# Altium schematic sheet Yitran_IT900_Hutschiene_PIM7A_908_1_4_und_Adapter_2.SchDoc
size 286 x 202 mm
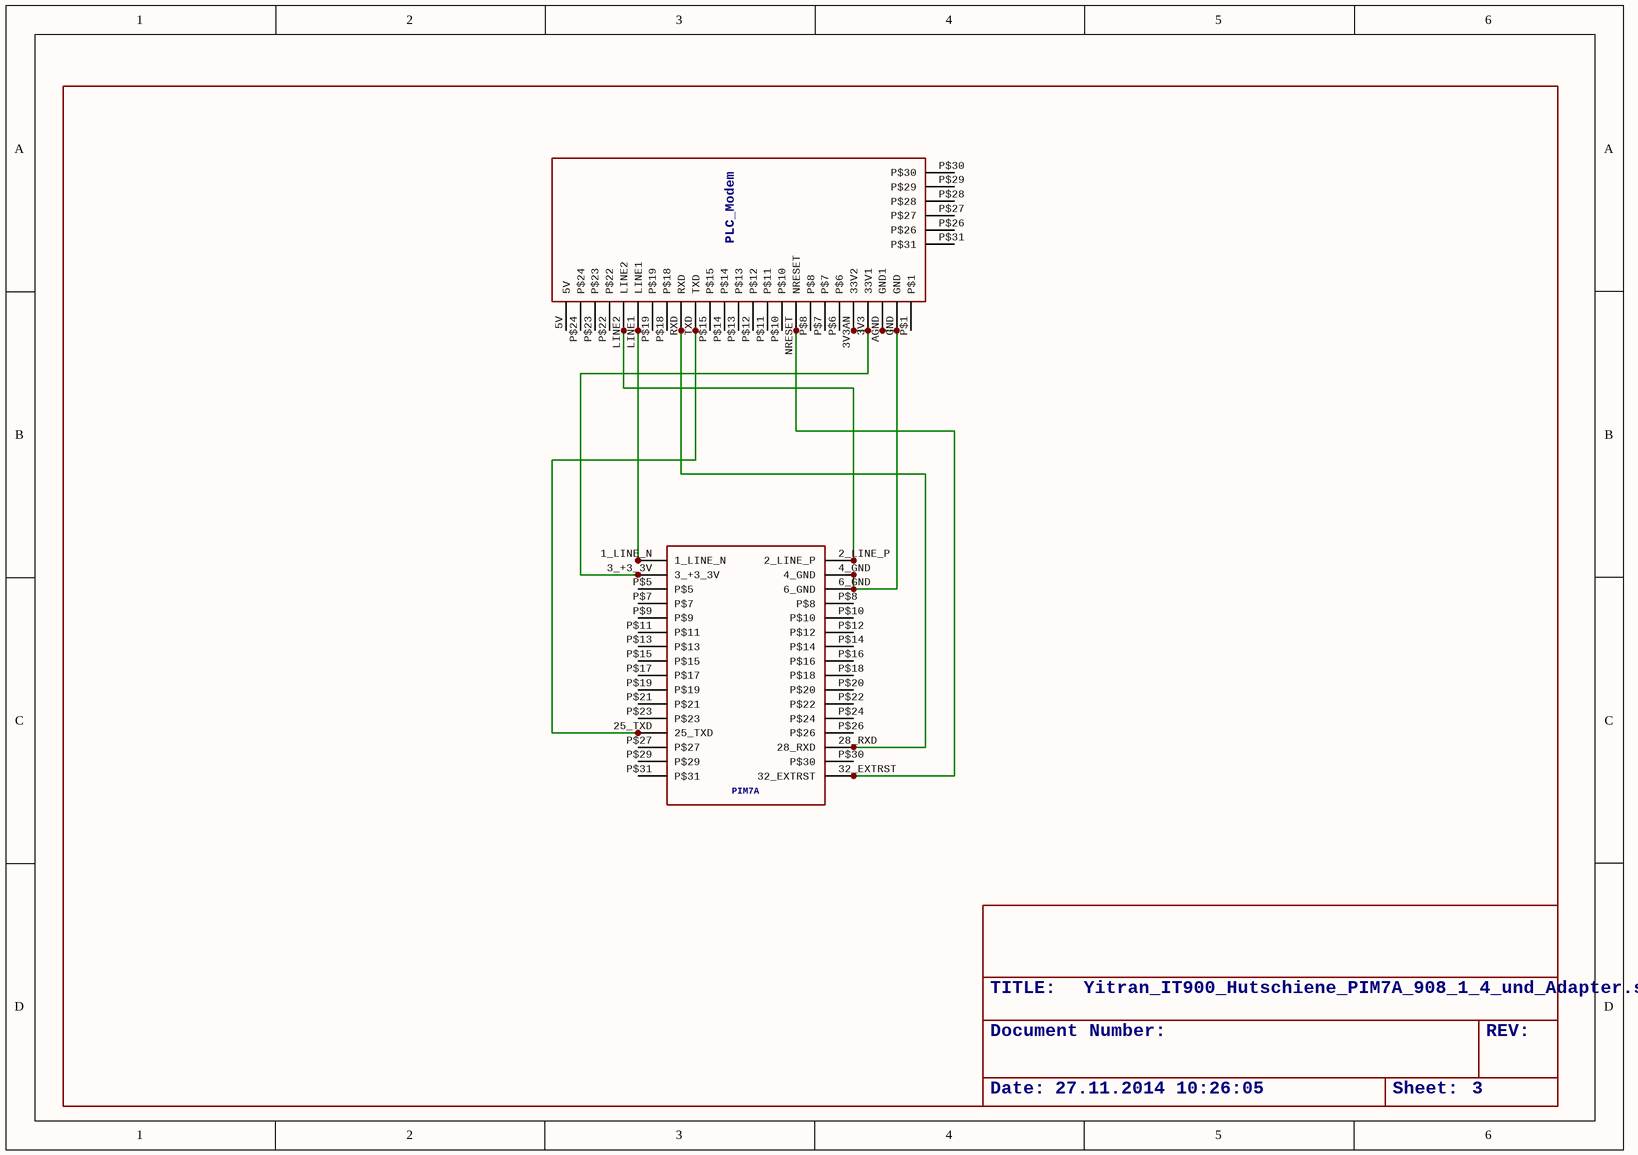
[diagram p0: Yitran_IT900_Hutschiene_PIM7A_908_1_4_und_Adapter_2.SchDoc]

## Parts
FRAME3  DINA4_L  (value not drawn)  (parts A,B of 2)
U$7  MODEMSTECKER_KLEINE_PINS  [MODEM_FUSS_KLEINE_PINS]  (value not drawn)
U$8  IT900PIM7A  [IT900PIM7A]  (value not drawn)

## Nets
NetU$7_3V3: U$7.3V3(33V1) U$7.3V3AN(33V2) U$8.3_+3_3V
NetU$7_AGND: U$7.AGND(GND1) U$7.GND U$8.4_GND U$8.6_GND
NetU$7_LINE1: U$7.LINE1 U$8.1_LINE_N
NetU$7_LINE2: U$7.LINE2 U$8.2_LINE_P
NetU$7_NRESET: U$7.NRESET U$8.32_EXTRST
NetU$7_RXD: U$7.RXD U$8.28_RXD
NetU$7_TXD: U$7.TXD U$8.25_TXD

Not connected (* = marked no-connect by the designer): U$7 5V P$1 P$6 P$7 P$8 P$10 P$11 P$12 P$13 P$14 P$15 P$18 P$19 P$22 P$23 P$24 P$26 P$27 P$28 P$29 P$30 P$31; U$8 P$5 P$7 P$8 P$9 P$10 P$11 P$12 P$13 P$14 P$15 P$16 P$17 P$18 P$19 P$20 P$21 P$22 P$23 P$24 P$26 P$27 P$29 P$30 P$31

## Library data of the parts
FRAME3 = DINA4_L: <b>FRAME</b><p> / DIN A4, landscape with extra doc field
U$7 = MODEMSTECKER_KLEINE_PINS: PLC_Modem: PLC_Modem
U$8 = IT900PIM7A: PIM7A: PIM7A